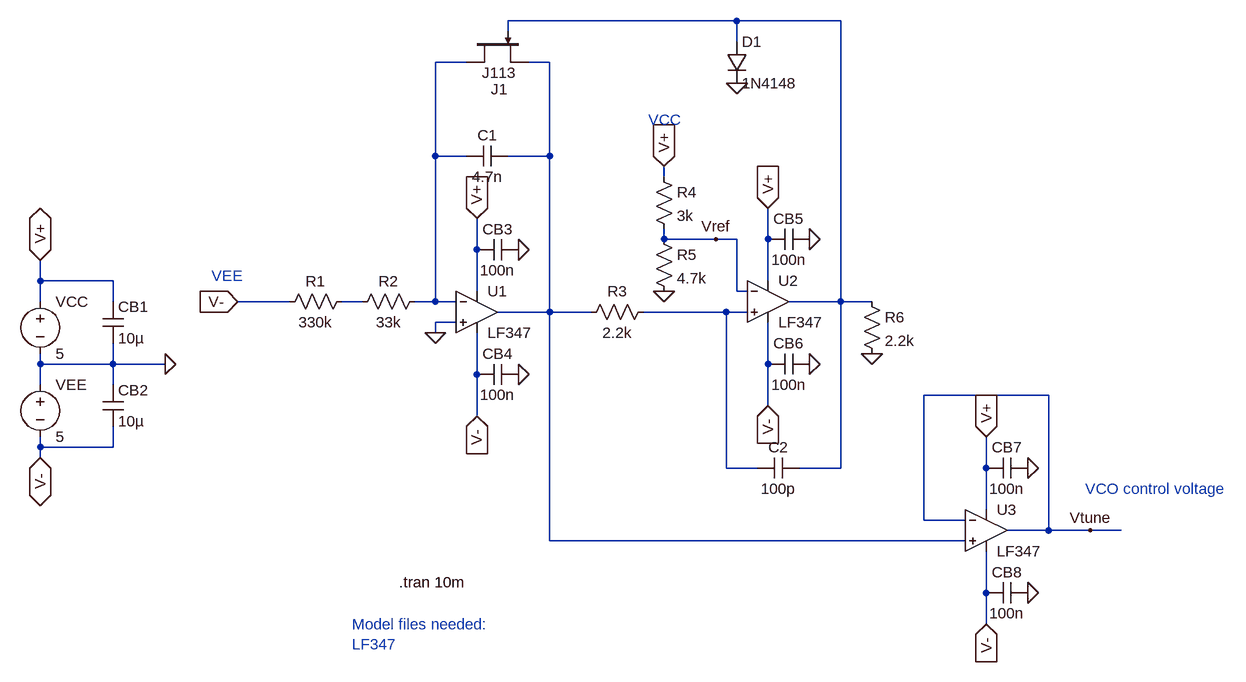
[diagram p0: schematic Sawtooth Core.asc]
Sawtooth Core.asc, the LTspice schematic file:
Version 4
SHEET 1 1828 872
WIRE 608 -496 256 -496
WIRE 768 -496 608 -496
WIRE 256 -480 256 -496
WIRE 608 -464 608 -496
WIRE 192 -432 144 -432
WIRE 320 -432 288 -432
WIRE 144 -288 144 -432
WIRE 192 -288 144 -288
WIRE 320 -288 320 -432
WIRE 320 -288 256 -288
WIRE 496 -256 496 -272
WIRE 496 -160 496 -176
WIRE 576 -160 496 -160
WIRE 608 -160 576 -160
WIRE 656 -160 656 -208
WIRE 208 -144 208 -192
WIRE -464 -96 -464 -128
WIRE -352 -96 -464 -96
WIRE 656 -96 656 -160
WIRE 208 -80 208 -144
WIRE 608 -80 608 -160
WIRE 624 -80 608 -80
WIRE -464 -64 -464 -96
WIRE -352 -64 -352 -96
WIRE -80 -64 -160 -64
WIRE 32 -64 0 -64
WIRE 144 -64 144 -288
WIRE 144 -64 112 -64
WIRE 176 -64 144 -64
WIRE 768 -64 768 -496
WIRE 768 -64 688 -64
WIRE 816 -64 768 -64
WIRE 320 -48 320 -288
WIRE 320 -48 240 -48
WIRE 384 -48 320 -48
WIRE 592 -48 464 -48
WIRE 624 -48 592 -48
WIRE 176 -32 144 -32
WIRE 144 -16 144 -32
WIRE -464 32 -464 16
WIRE -352 32 -352 0
WIRE -352 32 -464 32
WIRE -272 32 -352 32
WIRE 656 32 656 -32
WIRE 208 48 208 -16
WIRE -464 64 -464 32
WIRE -352 64 -352 32
WIRE 1088 80 896 80
WIRE 656 96 656 32
WIRE 208 112 208 48
WIRE -464 160 -464 144
WIRE -352 160 -352 128
WIRE -352 160 -464 160
WIRE -464 176 -464 160
WIRE 592 192 592 -48
WIRE 640 192 592 192
WIRE 768 192 768 -64
WIRE 768 192 704 192
WIRE 992 192 992 144
WIRE 992 256 992 192
WIRE 896 272 896 80
WIRE 960 272 896 272
WIRE 1088 288 1088 80
WIRE 1088 288 1024 288
WIRE 1152 288 1088 288
WIRE 1200 288 1152 288
WIRE 320 304 320 -48
WIRE 960 304 320 304
WIRE 992 384 992 320
WIRE 992 432 992 384
FLAG -272 32 0
FLAG -464 -128 V+
IOPIN -464 -128 BiDir
FLAG -464 176 V-
IOPIN -464 176 BiDir
FLAG 144 -16 0
FLAG 816 16 0
FLAG 496 -80 0
FLAG 608 -400 0
FLAG 720 -160 0
FLAG 720 32 0
FLAG 272 -144 0
FLAG 272 48 0
FLAG 208 -192 V+
IOPIN 208 -192 In
FLAG 208 112 V-
IOPIN 208 112 In
FLAG 656 96 V-
IOPIN 656 96 In
FLAG 656 -208 V+
IOPIN 656 -208 In
FLAG 992 144 V+
IOPIN 992 144 In
FLAG 992 432 V-
IOPIN 992 432 In
FLAG 1056 192 0
FLAG 1056 384 0
FLAG 1152 288 Vtune
FLAG 496 -272 V+
IOPIN 496 -272 In
FLAG -160 -64 V-
IOPIN -160 -64 In
FLAG 576 -160 Vref
SYMBOL voltage -464 -80 R0
SYMATTR InstName VCC
SYMATTR Value 5
SYMBOL voltage -464 48 R0
SYMATTR InstName VEE
SYMATTR Value 5
SYMBOL Cap -368 -64 R0
SYMATTR InstName CB1
SYMATTR Value 10µ
SYMBOL Cap -368 64 R0
SYMATTR InstName CB2
SYMATTR Value 10µ
SYMBOL Cap 256 -304 R90
WINDOW 0 0 32 VBottom 2
WINDOW 3 32 32 VTop 2
SYMATTR InstName C1
SYMATTR Value 4.7n
SYMATTR SpiceLine IC=0
SYMBOL Res 800 -80 R0
SYMATTR InstName R6
SYMATTR Value 2.2k
SYMBOL Cap 704 176 R90
WINDOW 0 0 32 VBottom 2
WINDOW 3 32 32 VTop 2
SYMATTR InstName C2
SYMATTR Value 100p
SYMBOL LF347/LF347 208 -112 R0
SYMATTR InstName U1
SYMBOL LF347/LF347 656 -128 R0
SYMATTR InstName U2
SYMBOL Res 480 -64 R90
WINDOW 0 0 56 VBottom 2
WINDOW 3 32 56 VTop 2
SYMATTR InstName R3
SYMATTR Value 2.2k
SYMBOL Res 480 -272 R0
SYMATTR InstName R4
SYMATTR Value 3k
SYMBOL Res 480 -176 R0
SYMATTR InstName R5
SYMATTR Value 4.7k
SYMBOL njf 192 -480 M90
WINDOW 0 89 38 VRight 2
WINDOW 3 64 24 VRight 2
SYMATTR InstName J1
SYMATTR Value J113
SYMBOL diode 592 -464 R0
SYMATTR InstName D1
SYMATTR Value 1N4148
SYMBOL LF347/LF347 992 224 R0
SYMATTR InstName U3
SYMBOL Cap 720 16 R90
WINDOW 0 0 32 VBottom 2
WINDOW 3 32 32 VTop 2
SYMATTR InstName CB6
SYMATTR Value 100n
SYMBOL Cap 720 -176 R90
WINDOW 0 0 32 VBottom 2
WINDOW 3 32 32 VTop 2
SYMATTR InstName CB5
SYMATTR Value 100n
SYMBOL Cap 272 32 R90
WINDOW 0 0 32 VBottom 2
WINDOW 3 32 32 VTop 2
SYMATTR InstName CB4
SYMATTR Value 100n
SYMBOL Cap 272 -160 R90
WINDOW 0 0 32 VBottom 2
WINDOW 3 32 32 VTop 2
SYMATTR InstName CB3
SYMATTR Value 100n
SYMBOL Cap 1056 368 R90
WINDOW 0 0 32 VBottom 2
WINDOW 3 32 32 VTop 2
SYMATTR InstName CB8
SYMATTR Value 100n
SYMBOL Cap 1056 176 R90
WINDOW 0 0 32 VBottom 2
WINDOW 3 32 32 VTop 2
SYMATTR InstName CB7
SYMATTR Value 100n
SYMBOL Res 128 -80 R90
WINDOW 0 0 56 VBottom 2
WINDOW 3 32 56 VTop 2
SYMATTR InstName R2
SYMATTR Value 33k
SYMBOL Res 16 -80 R90
WINDOW 0 0 56 VBottom 2
WINDOW 3 32 56 VTop 2
SYMATTR InstName R1
SYMATTR Value 330k
TEXT 88 368 Left 2 !.tran 10m
TEXT 1144 224 Left 2 ;VCO control voltage
TEXT 472 -344 Left 2 ;VCC
TEXT -200 -104 Left 2 ;VEE
TEXT 16 432 Left 2 ;Model files needed:\nLF347

The netlist it stands for:
* Sawtooth Core.asc
VCC V+ 0 5
VEE 0 V- 5
CB1 V+ 0 10µ
CB2 0 V- 10µ
C1 N003 N002 4.7n IC=0
R6 N001 0 2.2k
C2 N001 N005 100p
* U1: LF347 (symbol LF347/LF347 not available, pins judged from their places): In+=0 In-=N002 V+=V+ V-=V- OUT=N003
* U2: LF347 (symbol LF347/LF347 not available, pins judged from their places): In+=N005 In-=Vref V+=V+ V-=V- OUT=N001
R3 N005 N003 2.2k
R4 V+ Vref 3k
R5 Vref 0 4.7k
J1 N002 N001 N003 J113
D1 N001 0 1N4148
* U3: LF347 (symbol LF347/LF347 not available, pins judged from their places): In+=N003 In-=Vtune V+=V+ V-=V- OUT=Vtune
CB6 0 V- 100n
CB5 0 V+ 100n
CB4 0 V- 100n
CB3 0 V+ 100n
CB8 0 V- 100n
CB7 0 V+ 100n
R2 N002 N004 33k
R1 N004 V- 330k
.model D D
.lib standard.dio
.model NJF NJF
.model PJF PJF
.lib standard.jft
.tran 10m
* VCO control voltage
* VCC
* VEE
* Model files needed:
* LF347
.backanno
.end